# EAGLE design ATMEGA328_SUMO (EAGLE 9.5.2)
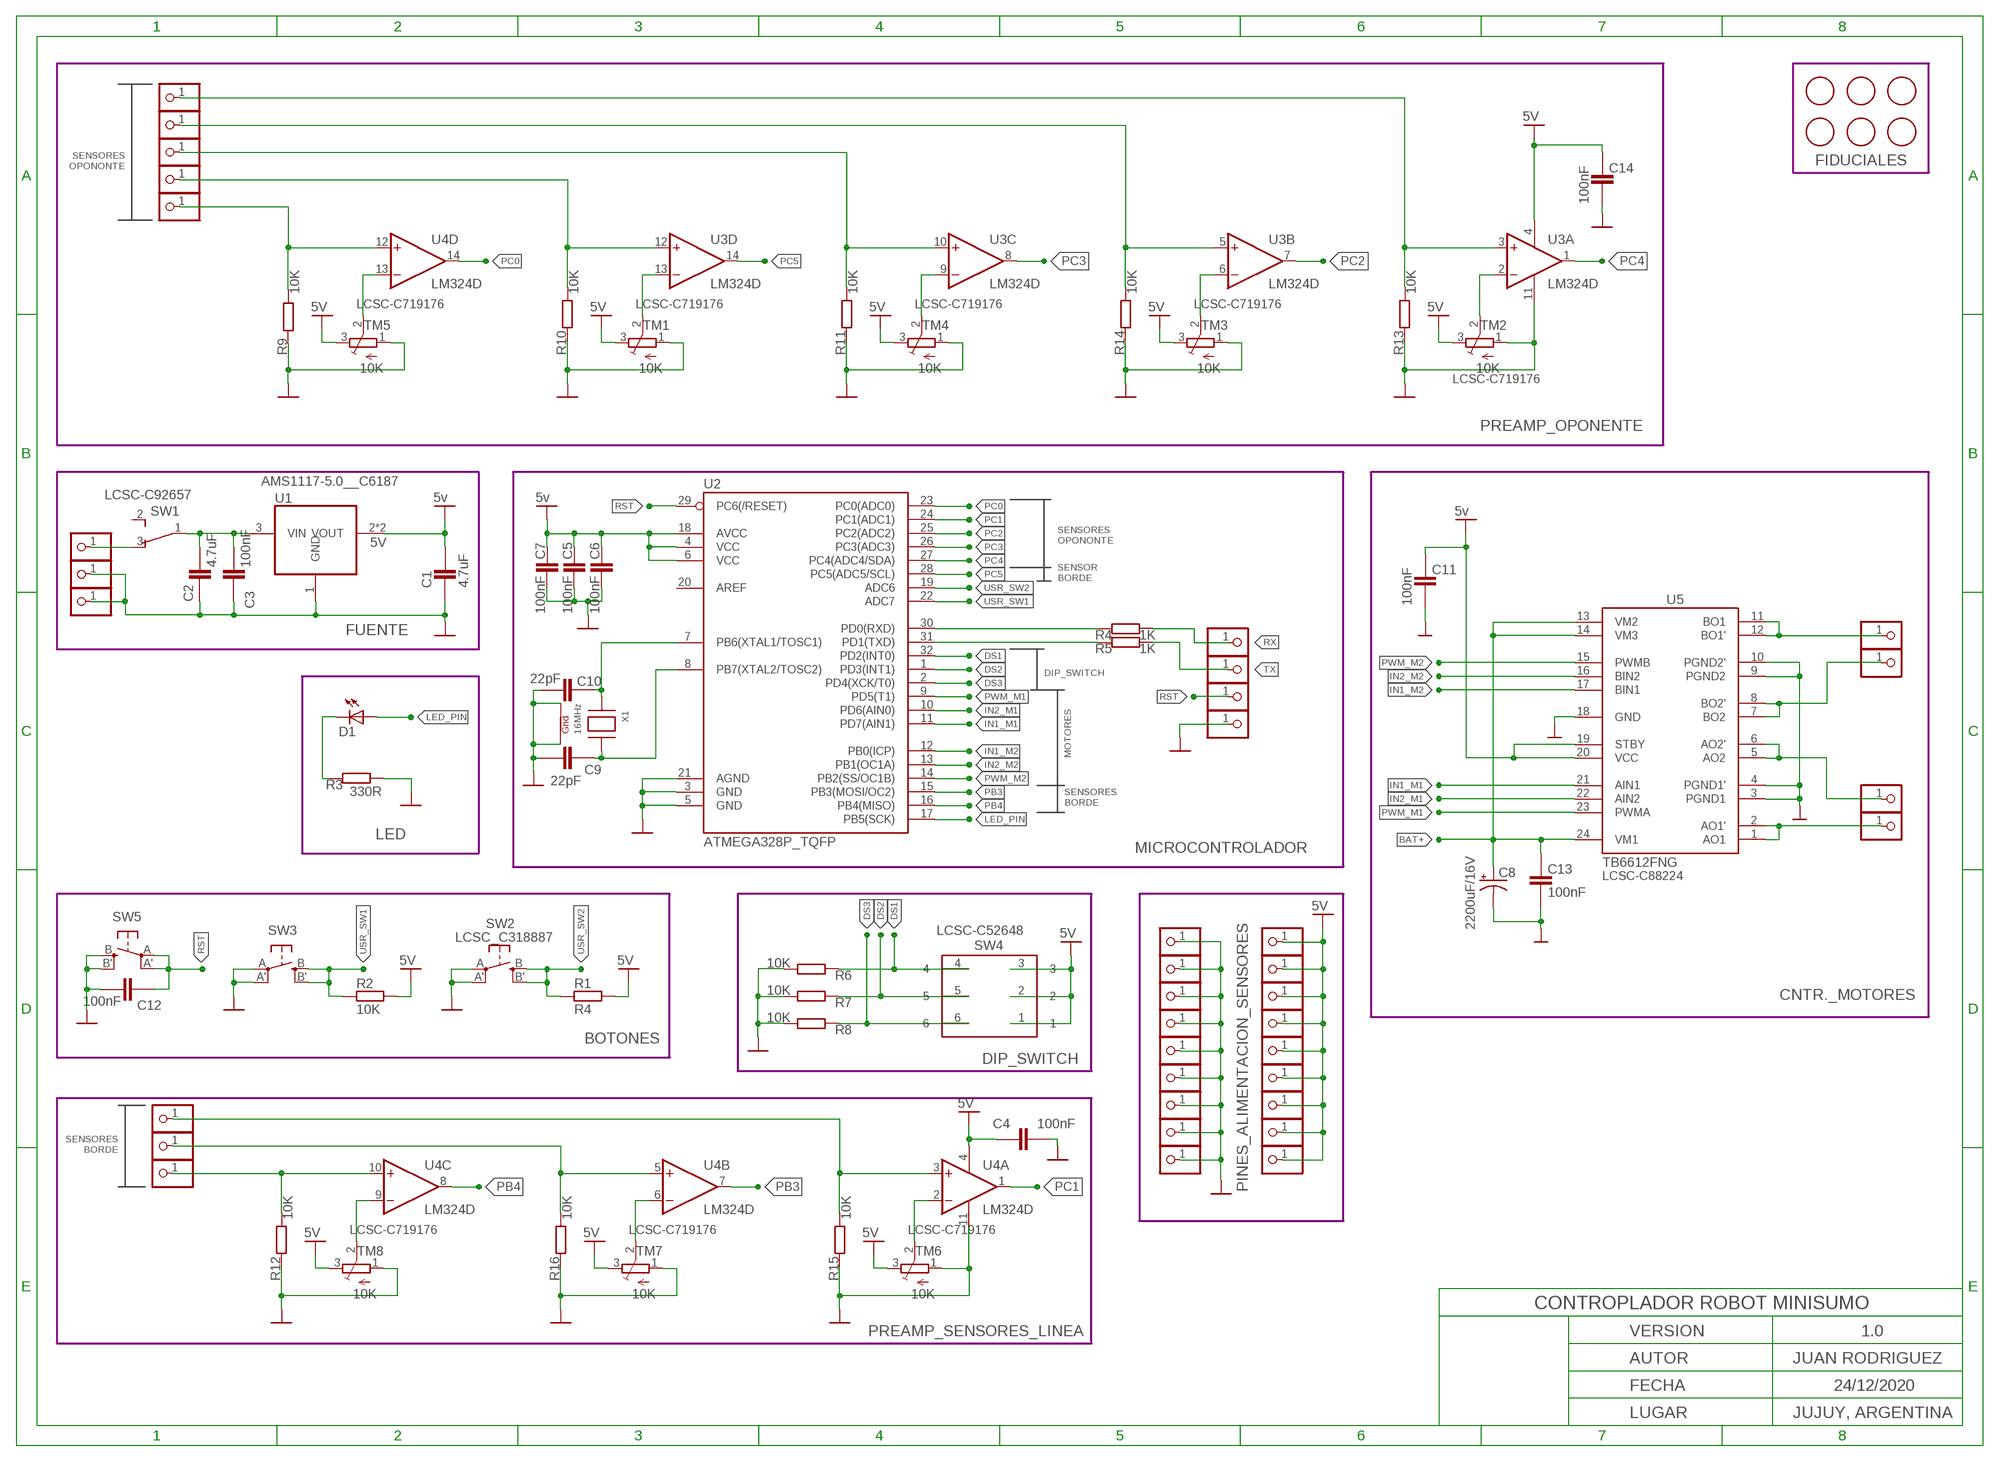
[diagram p0: schematic, sheet 1]

## Parts
C1  4.7uF  CAPACITOR_0603  [CAPC1608X92N]
C2  4.7uF  CAPACITOR_0603  [CAPC1608X92N]
C3  100nF  CAPACITOR_0603  [CAPC1608X92N]
C4  100nF  CAPACITOR_0603  [CAPC1608X92N]
C5  100nF  C-EUC0603  [C0603]
C6  100nF  C-EUC0603  [C0603]
C7  100nF  C-EUC0603  [C0603]
C8  2200uF/16V  CAP_POLG  [PANASONIC_G]
C9  22pF  CAPACITOR_0603  [CAPC1608X92N]
C10  22pF  CAPACITOR_0603  [CAPC1608X92N]
C11  100nF  CAPACITOR_0603  [CAPC1608X92N]
C12  100nF  CAPACITOR_0603  [CAPC1608X92N]
C13  100nF  CAPACITOR_0603  [CAPC1608X92N]
C14  100nF  CAPACITOR_0603  [CAPC1608X92N]
D1  LEDCHIP-LED0805  [CHIP-LED0805]
JP1  PINHD-1X1  [1X01]
JP2  PINHD-1X1  [1X01]
JP3  PINHD-1X1  [1X01]
JP4  PINHD-1X1  [1X01]
JP5  PINHD-1X1  [1X01]
JP6  PINHD-1X1  [1X01]
JP7  PINHD-1X1  [1X01]
JP8  PINHD-1X1  [1X01]
JP9  PINHD-1X1  [1X01]
JP10  PINHD-1X1  [1X01]
JP11  PINHD-1X1  [1X01]
JP12  PINHD-1X1  [1X01]
JP13  PINHD-1X1  [1X01]
JP14  PINHD-1X1  [1X01]
JP15  PINHD-1X1  [1X01]
JP16  PINHD-1X1  [1X01]
JP17  PINHD-1X1  [1X01]
JP18  PINHD-1X1  [1X01]
JP19  PINHD-1X1  [1X01]
JP20  PINHD-1X1  [1X01]
JP21  PINHD-1X1  [1X01]
JP22  PINHD-1X1  [1X01]
JP23  PINHD-1X1  [1X01]
JP24  PINHD-1X1  [1X01]
JP25  PINHD-1X1  [1X01]
JP26  PINHD-1X1  [1X01]
JP27  PINHD-1X1  [1X01]
JP28  PINHD-1X1  [1X01]
JP29  PINHD-1X1  [1X01]
JP30  PINHD-1X1  [1X01]
JP31  PINHD-1X1  [1X01]
JP32  PINHD-1X1  [1X01]
JP33  PINHD-1X1  [1X01]
MOT-1A1  PINHD-1X1  [1X01]
MOT-1A2  PINHD-1X1  [1X01]
MOT-1B1  PINHD-1X1  [1X01]
MOT-1B2  PINHD-1X1  [1X01]
R1  R4  RESISTOR_0603  [RESC1608X55N]
R2  10K  RESISTOR_0603  [RESC1608X55N]
R3  330R  RESISTOR_0603  [RESC1608X55N]
R4  1K  RESISTOR_0603  [RESC1608X55N]
R5  1K  RESISTOR_0603  [RESC1608X55N]
R6  10K  RESISTOR_0603  [RESC1608X55N]
R7  10K  RESISTOR_0603  [RESC1608X55N]
R8  10K  RESISTOR_0603  [RESC1608X55N]
R9  10K  RESISTOR_0603  [RESC1608X55N]
R10  10K  RESISTOR_0603  [RESC1608X55N]
R11  10K  RESISTOR_0603  [RESC1608X55N]
R12  10K  RESISTOR_0603  [RESC1608X55N]
R13  10K  RESISTOR_0603  [RESC1608X55N]
R14  10K  RESISTOR_0603  [RESC1608X55N]
R15  10K  RESISTOR_0603  [RESC1608X55N]
R16  10K  RESISTOR_0603  [RESC1608X55N]
SW1  LCSC-C92657  450302014072  [450302014072]
SW2  LCSC_C318887  SPST_TACT-EVQQ2  [EVQ-Q2]
SW3  SPST_TACT-EVQQ2__C318887  SPST_TACT-EVQQ2  [EVQ-Q2]
SW4  LCSC-C52648  418117170903  [418117170903]
SW5  SPST_TACT-EVQQ2__C318887  SPST_TACT-EVQQ2  [EVQ-Q2]
TM1  10K  TRIMPOTTC33X  [TC33X]
TM2  10K  TRIMPOTTC33X  [TC33X]
TM3  10K  TRIMPOTTC33X  [TC33X]
TM4  10K  TRIMPOTTC33X  [TC33X]
TM5  10K  TRIMPOTTC33X  [TC33X]
TM6  10K  TRIMPOTTC33X  [TC33X]
TM7  10K  TRIMPOTTC33X  [TC33X]
TM8  10K  TRIMPOTTC33X  [TC33X]
U1  AMS1117-5.0__C6187  REG1118-5  [SOT-223]
U2  ATMEGA328P_TQFP  [TQFP32-08]
U3  LM324D  [SO14]
U4  LM324D  [SO14]
U5  TB6612FNG  [SSOP24]
U$1  FIDUCIAL  [FIDUCIAL_1MM]
U$3  FIDUCIAL  [FIDUCIAL_1MM]
U$4  FIDUCIAL  [FIDUCIAL_1MM]
U$100  FIDUCIAL  [FIDUCIAL_1MM]
U$101  FIDUCIAL  [FIDUCIAL_1MM]
U$102  FIDUCIAL  [FIDUCIAL_1MM]
X1  16MHz  XTAL-4-3225  [NX3225]

## Module instances
PREAMP_SENSORES_LINEA = PREAMP_LINEA
FUENTE = POWER_SUPPLY
LED = IRL_Y_EDS
BOTONES = BOTONES
DIP_SWITCH = DIP_SWWITCH
MICROCONTROLADOR = MICROCONTROLADOR
CNTR._MOTORES = CONTR._MOTORES
PINES_ALIMENTACION_SENSORES = PINES_ALIMENTACION_SENSORES
FIDUCIALES = FIDUCIALES
PREAMP_OPONENTE = PREAMP_OPONENTE

## Nets
5V: C1.2 C4.1 C5.1 C6.1 C7.1 C11.1 C14.1 JP16.1 JP17.1 JP18.1 JP19.1 JP20.1 JP21.1 JP22.1 JP23.1 JP24.1 R1.2 R2.2 SW4.1 SW4.2 SW4.3 TM1.3(E) TM2.3(E) TM3.3(E) TM4.3(E) TM5.3(E) TM6.3(E) TM7.3(E) TM8.3(E) U1.2(VOUT) U1.4(VOUT) U2.4(VCC) U2.6(VCC) U2.18(AVCC) U3.4(P:V+) U4.4(P:V+) U5.19(STBY) U5.20(VCC) ; supply symbol labelled 5v
BAT+: C2.2 C3.2 C8.+ C13.2 SW1.1 U1.3(VIN) U5.13(VM2) U5.14(VM3) U5.24(VM1)
DS1: R6.1 SW4.4 U2.32(PD2(INT0))
DS2: R7.1 SW4.5 U2.1(PD3(INT1))
DS3: R8.1 SW4.6 U2.2(PD4(XCK/T0))
GND: C1.1 C2.1 C3.1 C4.2 C5.2 C6.2 C7.2 C8.- C9.2 C10.2 C11.2 C12.2 C13.1 C14.2 JP2.1 JP3.1 JP4.1 JP25.1 JP26.1 JP27.1 JP28.1 JP29.1 JP30.1 JP31.1 JP32.1 JP33.1 R3.1 R6.2 R7.2 R8.2 R9.2 R10.1 R11.1 R12.1 R13.1 R14.1 R15.1 R16.1 SW2.A'(P1) SW2.A(P) SW3.A'(P1) SW3.A(P) SW5.B'(S1) SW5.B(S) TM1.1(A) TM2.1(A) TM3.1(A) TM4.1(A) TM5.1(A) TM6.1(A) TM7.1(A) TM8.1(A) U1.1(GND) U2.3(GND) U2.5(GND) U2.21(AGND) U3.11(P:V-) U4.11(P:V-) U5.3(PGND1) U5.4(PGND1') U5.9(PGND2) U5.10(PGND2') U5.18(GND) X1.2(G2) X1.4(G1)
IN1_M1: U2.11(PD7(AIN1)) U5.21(AIN1)
IN1_M2: U2.12(PB0(ICP)) U5.17(BIN1)
IN2_M1: U2.10(PD6(AIN0)) U5.22(AIN2)
IN2_M2: U2.13(PB1(OC1A)) U5.16(BIN2)
LED_PIN: D1.A U2.17(PB5(SCK))
N$1: D1.C R3.2
N$5: JP10.1 R14.2 U3.5(B:+IN)
N$7: JP11.1 R11.2 U3.10(C:+IN)
N$10: TM2.2(S) U3.2(A:-IN)
N$11: TM3.2(S) U3.6(B:-IN)
N$12: TM4.2(S) U3.9(C:-IN)
N$15: MOT-1B2.1 U5.5(AO2) U5.6(AO2')
N$16: TM1.2(S) U3.13(D:-IN)
N$18: TM5.2(S) U4.13(D:-IN)
N$19: JP12.1 R9.1 U4.12(D:+IN)
N$20: TM6.2(S) U4.2(A:-IN)
N$21: JP8.1 R10.2 U3.12(D:+IN)
N$22: JP13.1 R15.2 U4.3(A:+IN)
N$23: JP9.1 R13.2 U3.3(A:+IN)
N$24: MOT-1B1.1 U5.1(AO1) U5.2(AO1')
N$26: C9.1 U2.8(PB7(XTAL2/TOSC2)) X1.1(X1)
N$27: C10.1 U2.7(PB6(XTAL1/TOSC1)) X1.3(X2)
N$28: MOT-1A2.1 U5.11(BO1) U5.12(BO1')
N$29: MOT-1A1.1 U5.7(BO2) U5.8(BO2')
N$31: TM7.2(S) U4.6(B:-IN)
N$38: JP15.1 R16.2 U4.5(B:+IN)
N$41: JP1.1 SW1.3
N$47: TM8.2(S) U4.9(C:-IN)
N$48: JP14.1 R12.2 U4.10(C:+IN)
PB3: U2.15(PB3(MOSI/OC2)) U4.7(B:OUT)
PB4: U2.16(PB4(MISO)) U4.8(C:OUT)
PC0: U2.23(PC0(ADC0)) U4.14(D:OUT)
PC1: U2.24(PC1(ADC1)) U4.1(A:OUT)
PC2: U2.25(PC2(ADC2)) U3.7(B:OUT)
PC3: U2.26(PC3(ADC3)) U3.8(C:OUT)
PC4: U2.27(PC4(ADC4/SDA)) U3.1(A:OUT)
PC5: U2.28(PC5(ADC5/SCL)) U3.14(D:OUT)
PWM_M1: U2.9(PD5(T1)) U5.23(PWMA)
PWM_M2: U2.14(PB2(SS/OC1B)) U5.15(PWMB)
RST: C12.1 JP5.1 SW5.A'(P1) SW5.A(P) U2.29(PC6(/RESET))
RX: JP6.1 R4.1
RX.: R4.2 U2.30(PD0(RXD))
TX: JP7.1 R5.1
TX.: R5.2 U2.31(PD1(TXD))
USR_SW1: R2.1 SW3.B'(S1) SW3.B(S) U2.22(ADC7)
USR_SW2: R1.1 SW2.B'(S1) SW2.B(S) U2.19(ADC6)
Unconnected: SW1.2 U2.20(AREF)

## Notes on the sheet
- SENSORES
  OPONONTE
- LCSC-C719176 | LCSC-C719176 | LCSC-C719176 | LCSC-C719176
- LCSC-C719176
- SENSORES
  OPONONTE
- SENSOR
  BORDE
- DIP_SWITCH
- MOTORES
- SENSORES
  BORDE
- LCSC-C88224
- SENSORES
  BORDE
- LCSC-C719176 | LCSC-C719176 | LCSC-C719176
- CONTROPLADOR ROBOT MINISUMO
- VERSION | 1.0
- AUTOR | JUAN RODRIGUEZ
- FECHA | 24/12/2020
- LUGAR | JUJUY, ARGENTINA

## Library data of the parts
C1-C4 C9-C14 = ipc-7351-capacitor:CAPACITOR_
C5-C7 = rcl:C-EU: CAPACITOR, European symbol
C8 = SparkFun-Passives:CAP_POL: Capacitor Polarized These are standard SMD and PTH capacitors. Normally 10uF, 47uF, and 100uF in electrolytic and tantalum varieties. Always verify the external diameter of the through hole cap, it varies with capacity, voltage, and manufacturer. The EIA devices should be standard.
D1 = adafruit:LED: LED OSRAM: - CHIPLED LG R971, LG N971, LY N971, LG Q971, LY Q971, LO R971, LY R971 LH N974, LH R974 LS Q976, LO Q976, LY Q976 LO Q996 - Hyper CHIPLED LW Q18S LB Q993, LB Q99A, LB R99A - SideLED LS A670, LO A670, LY A670, LG A670, LP A670 LB A673, LV A673, LT A673, LW A673 LH A674 LY A675 LS A676, LA A676, LO A676, LY A676, LW A676 LS A679, LY A679, LG A679 - Hyper Micro SIDELED® LS Y876, LA Y876, LO Y876, LY Y876 LT Y87S - SmartLED LW L88C, LW L88S LB L89C, LB L89S, LG L890 LS L89K, LO L89K, LY L89K LS L896, LA L896, LO L896, LY L896 - TOPLED LS T670, LO T670, LY T670, LG T670, LP T670 LSG T670, LSP T670, LSY T670, LOP T670, LYG T670 LG T671, LOG T671, LSG T671 LB T673, LV T673, LT T673, LW T673 LH T674 LS T676, LA T676, LO T676, LY T676, LB T676, LH T676, LSB T676, LW T676 LB T67C, LV T67C, LT T67C, LS T67K, LO T67K, LY T67K, LW E67C LS E67B, LA E67B, LO E67B, LY E67B, LB E67C, LV E67C, LT E67C LW T67C LS T679, LY T679, LG T679 LS T770, LO T770, LY T770, LG T770, LP T770 LB T773, LV T773, LT T773, LW T773 LH T774 LS E675, LA E675, LY E675, LS T675 LS T776, LA T776, LO T776, LY T776, LB T776 LHGB T686 LT T68C, LB T68C - Hyper Mini TOPLED® LB M676 - Mini TOPLED Santana® LG M470 LS M47K, LO M47K, LY M47K Source: http://www.osram.convergy.de/
JP1-JP33 MOT-1A1 MOT-1A2 MOT-1B1 MOT-1B2 = adafruit:PINHD-1X1: Pin header 1x1 for 0.1" spacing With round pins
R1-R16 = ipc-7351-resistor:RESISTOR_
SW1 = Eagle_Wuerth_Elektronik_Switch_rev15b:450302014072: WS-SUT, 10mm*2.5mm, SPDT, ON-ON, 2.54mm, right angle type, THT, Mini Slide Switch, 3 pins
SW2 SW3 SW5 = adafruit:SPST_TACT: SMT 6mm switch, EVQQ2 series http://www.ladyada.net/library/eagle
SW4 = Eagle_Wuerth_Elektronik_Switch_rev15b:418117170903: WS-BS 2.54 mm compact THT Dip Switch with flat actuator, 3 Pole
TM1-TM8 = adafruit:TRIMPOT: SMT trimmer potentiometer part number TC33X http://www.ladyada.net/library/eagle
U1 = burr-brown:REG1118-5: AMS1117 5V 1A LCSC N° C6187
U2 = SparkFun-DigitalIC:ATMEGA328P_TQFP; PROD_ID: IC-09069
U3 U4 = gm-ics:LM324: OP AMP
U5 = adafruit:TB6612FNG: TB6612FNG MOS dual H-bridge motor driver, 1.2A current 3.2A peak 3 or 5v logic and 3-15v motor
U$1 U$3 U$4 U$100-U$102 = adafruit:FIDUCIAL: For use by pick and place machines to calibrate the vision/machine, 1mm By microbuilder.eu
X1 = adafruit:XTAL-4: Classic 4-pin 3.2 x 2.5mm crystal

## Module PREAMP_LINEA
Ports: 

### Library data of the parts

## Module POWER_SUPPLY
Ports: 

### Library data of the parts

## Module IRL_Y_EDS
Ports: 

### Library data of the parts

## Module BOTONES
Ports: 

### Library data of the parts

## Module DIP_SWWITCH
Ports: 

### Library data of the parts

## Module MICROCONTROLADOR
Ports: 

### Library data of the parts

## Module CONTR._MOTORES
Ports: 

### Library data of the parts

## Module PINES_ALIMENTACION_SENSORES
Ports: 

### Library data of the parts

## Module FIDUCIALES
Ports: 

### Library data of the parts

## Module PREAMP_OPONENTE
Ports: 

### Library data of the parts

## Board
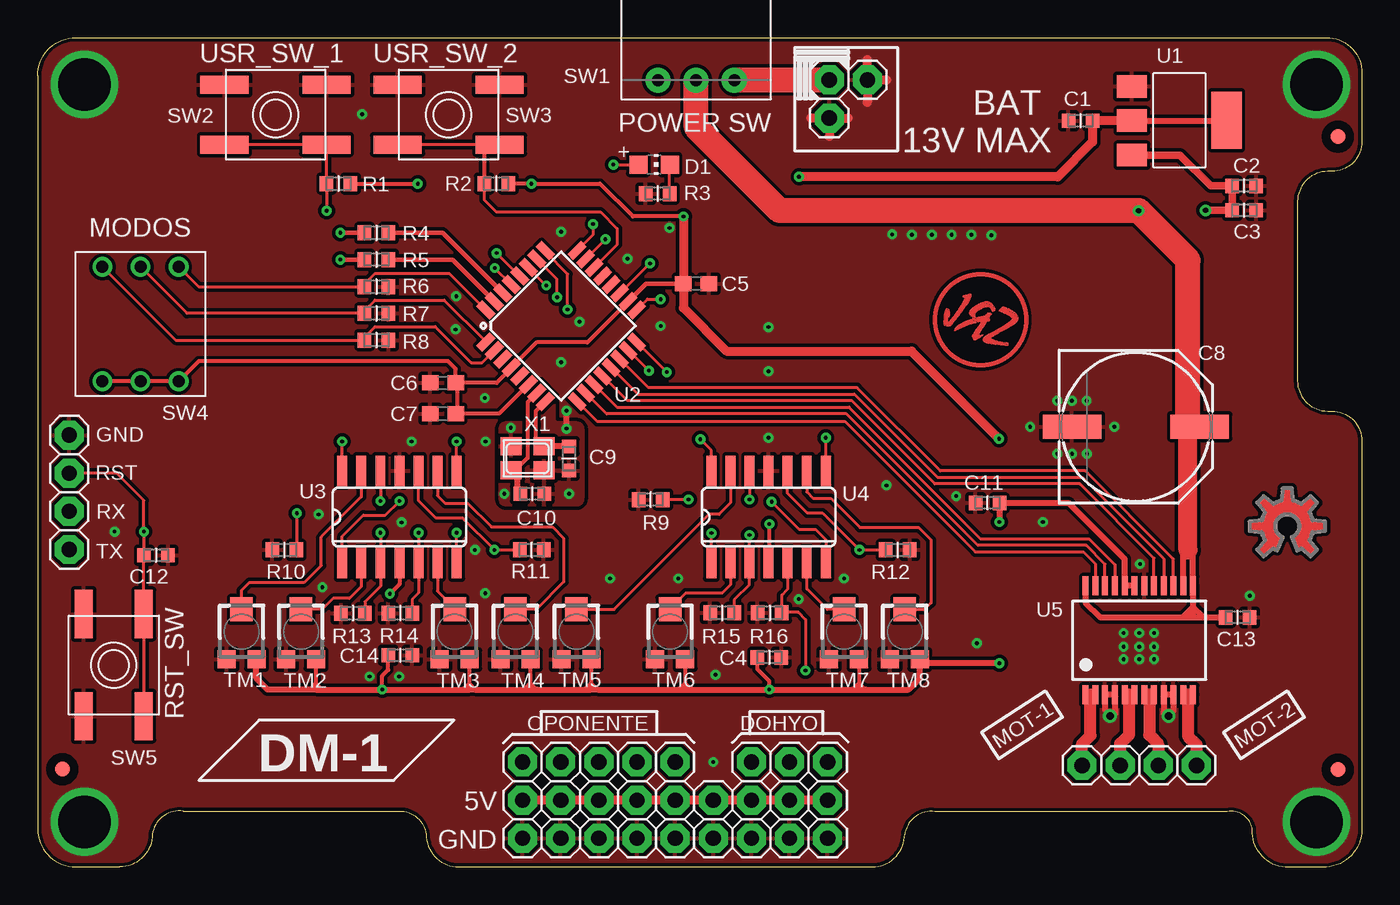
[diagram p1: board, top side]
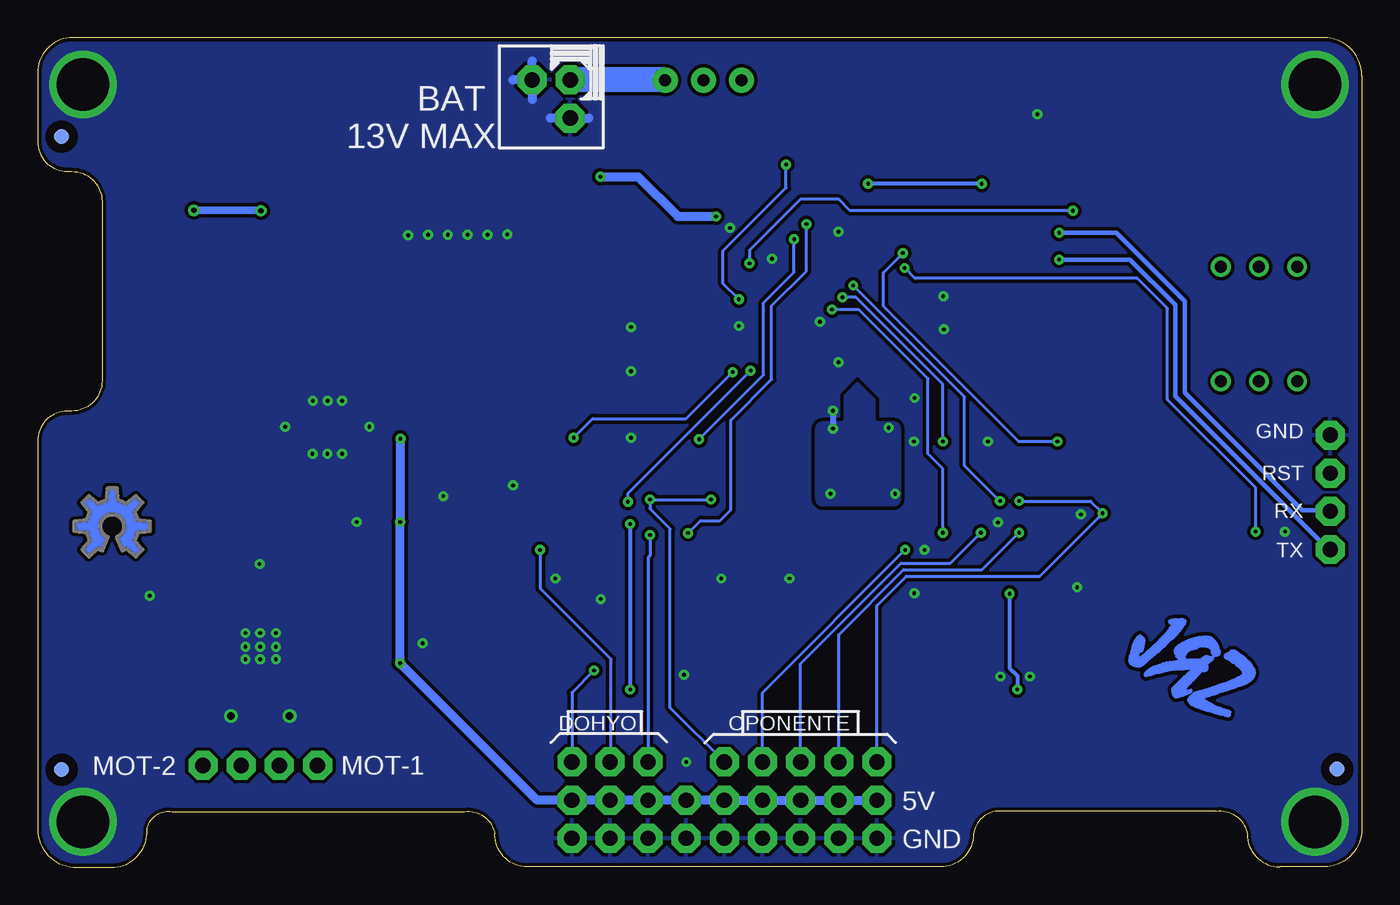
[diagram p2: board, bottom side, seen from below]

Size 88.21 x 55.24 mm. Coordinates in mm from the lower left corner, seen from the top.
Outline: 80.92,2.51 arc90 79.25,3.71 59.76,3.71 arc90 57.76,2.19 arc-90 55.59,0.03 28.05,0.03 arc-90 25.88,2.19 arc90 23.93,3.73 9.7,3.73 arc90 7.65,2.19 arc-90 5.48,0.03 2.54,0.03 arc-90 0,2.57 0,52.7 arc-90 2.54,55.24 85.84,55.24 arc-90 88.21,52.87 88.21,48.33 arc-90 86.21,46.33 85.92,46.33 arc90 83.92,44.33 83.92,32.38 arc90 85.92,30.38 86.21,30.38 arc-90 88.21,28.38 88.21,2.53 arc-90 85.61,0 83.11,0 arc-90 80.92,2.51
Copper layers (1*16): Top 0.035mm / dielectric 1.5mm / Bottom 0.035mm
Design rules "default *": minimum track width 6mil, minimum drill 0.25mm, track to track 9mil, track to pad 8mil, pad to pad 8mil, via to via 8mil, smd to smd 8mil, copper to edge 10mil, drill to drill 7mil, minimum pad ring 10mil, minimum via ring 8mil, stop-mask expansion 4mil, vias tented up to drill 0mil, thermal gap 10mil
tRestrict: 14 lines
bRestrict: 13 lines

### Footprints (pad centres in the part's own frame; a part is rotated, then mirrored left to right if it is on the bottom)
CAPC1608X92N = smd 0.9 x 0.95: 1 -0.8,0; 2 0.8,0
C0603 = smd 1.1 x 1: 1 -0.85,0; 2 0.85,0
PANASONIC_G = smd 3.9 x 1.6: + 4.25,0; - -4.25,0
CHIP-LED0805 = smd 1.2 x 1.2: A 0,-1.05; C 0,1.05
1X01 = drill 1.016 pad 1.93 octagon: 1 0,0
RESC1608X55N = smd 0.9 x 1: 1 -0.8,0; 2 0.8,0
450302014072 = drill 0.8 pad 1.676: 1 0,0; 2 -2.54,0; 3 2.54,0
EVQ-Q2 = smd 3.2 x 1.2: A -3.4,-2; A' 3.4,-2; B -3.4,2; B' 3.4,2
418117170903 = drill 0.8: 1 0,-3.81; 2 2.54,-3.81; 3 5.08,-3.81; 4 5.08,3.81; 5 2.54,3.81; 6 0,3.81
TC33X = smd 1.2 x 1.2: 1 -1,-1.825; 3 1,-1.825 | smd 1.5 x 1.6: 2 0,1.5
SOT-223 = smd 1.499 x 2.007: 1 -2.261,-3.15; 2 0.025,-3.15; 3 2.311,-3.15 | smd 3.81 x 2.007: 4 0,3.15
TQFP32-08 = smd 1.27 x 0.559: 1 -4.293,2.8; 2 -4.293,2; 3 -4.293,1.2; 4 -4.293,0.4; 5 -4.293,-0.4; 6 -4.293,-1.2; 7 -4.293,-2; 8 -4.293,-2.8; 17 4.293,-2.8; 18 4.293,-2; 19 4.293,-1.2; 20 4.293,-0.4; 21 4.293,0.4; 22 4.293,1.2; 23 4.293,2; 24 4.293,2.8 | smd 0.559 x 1.27: 9 -2.8,-4.293; 10 -2,-4.293; 11 -1.2,-4.293; 12 -0.4,-4.293; 13 0.4,-4.293; 14 1.2,-4.293; 15 2,-4.293; 16 2.8,-4.293; 25 2.8,4.293; 26 2,4.293; 27 1.2,4.293; 28 0.4,4.293; 29 -0.4,4.293; 30 -1.2,4.293; 31 -2,4.293; 32 -2.8,4.293
SO14 = smd 0.66 x 2.032: 1 -3.81,-3.073; 2 -2.54,-3.073; 3 -1.27,-3.073; 4 0,-3.073; 5 1.27,-3.073; 6 2.54,-3.073; 7 3.81,-3.073; 8 3.81,3.073; 9 2.54,3.073; 10 1.27,3.073; 11 0,3.073; 12 -1.27,3.073; 13 -2.54,3.073; 14 -3.81,3.073
SSOP24 = smd 0.4 x 1.25: 1 -3.575,-3.625; 2 -2.925,-3.625; 3 -2.275,-3.625; 4 -1.625,-3.625; 5 -0.975,-3.625; 6 -0.325,-3.625; 7 0.325,-3.625; 8 0.975,-3.625; 9 1.625,-3.625; 10 2.275,-3.625; 11 2.925,-3.625; 12 3.575,-3.625; 13 3.575,3.625; 14 2.925,3.625; 15 2.275,3.625; 16 1.625,3.625; 17 0.975,3.625; 18 0.325,3.625; 19 -0.325,3.625; 20 -0.975,3.625; 21 -1.625,3.625; 22 -2.275,3.625; 23 -2.925,3.625; 24 -3.575,3.625
FIDUCIAL_1MM = smd 1 x 1: 1 0,0
NX3225 = smd 1.4 x 1.2: 1 -1.1,-0.8; 2 1.1,-0.8; 3 1.1,0.8; 4 -1.1,0.8

### Placement (x,y rotation side)
C1  69.47,49.71 0 top
C2  80.37,45.36 180 top
C3  80.37,43.74 180 top
C4  48.74,13.97 0 top
C5  43.87,38.86 0 top
C6  27,32.26 180 top
C7  27,30.2 180 top
C8  73.15,29.34 0 top
C9  35.39,27.22 270 top
C10  32.94,24.87 0 top
C11  63.27,24.26 180 top
C12  7.9,20.78 0 top
C13  79.93,16.64 180 top
C14  24.16,14.12 0 top
D1  41.07,46.79 270 top
JP1  52.73,52.43 180 top
JP2  55.27,52.43 180 top
JP3  52.73,49.89 180 top
JP4  2.11,28.78 180 top
JP5  2.11,26.24 270 top
JP6  2.11,23.7 90 top
JP7  2.11,21.16 0 top
JP8  32.31,7.01 180 top
JP9  34.85,7.01 180 top
JP10  37.39,7.01 0 top
JP11  39.93,7.01 180 top
JP12  42.47,7.01 180 top
JP13  47.55,7.01 0 top
JP14  50.09,7.01 180 top
JP15  52.63,7.01 270 top
JP16  32.31,4.47 180 top
JP17  34.85,4.47 90 top
JP18  37.39,4.47 90 top
JP19  39.93,4.47 90 top
JP20  42.47,4.47 90 top
JP21  45.01,4.47 90 top
JP22  47.55,4.47 90 top
JP23  50.09,4.47 90 top
JP24  52.63,4.47 90 top
JP25  32.31,1.93 180 top
JP26  34.85,1.93 90 top
JP27  37.39,1.93 90 top
JP28  39.93,1.93 90 top
JP29  42.47,1.93 180 top
JP30  45.01,1.93 180 top
JP31  47.55,1.93 180 top
JP32  50.09,1.93 180 top
JP33  52.63,1.93 180 top
MOT-1A1  74.65,6.78 0 top
MOT-1A2  77.19,6.78 0 top
MOT-1B1  69.57,6.78 0 top
MOT-1B2  72.11,6.78 0 top
R1  20.04,45.52 0 top
R2  30.56,45.52 0 top
R3  41.3,44.86 0 top
R4  22.58,42.24 0 top
R5  22.58,40.46 0 top
R6  22.58,38.66 0 top
R7  22.58,36.88 0 top
R8  22.58,35.1 0 top
R9  40.84,24.49 180 top
R10  16.43,21.13 0 top
R11  32.92,21.13 180 top
R12  57.3,21.13 180 top
R13  21.01,16.92 0 top
R14  24.16,16.92 0 top
R15  45.59,16.94 0 top
R16  48.77,16.94 0 top
SW1  43.87,52.4 0 top
SW2  15.85,50.11 180 top
SW3  27.38,50.11 180 top
SW4  4.32,36.17 0 top
SW5  5.08,13.46 90 top
TM1  13.59,15.67 0 top
TM2  17.55,15.67 0 top
TM3  27.79,15.67 0 top
TM4  31.83,15.67 0 top
TM5  35.89,15.67 0 top
TM6  42.14,15.67 0 top
TM7  53.72,15.67 0 top
TM8  57.76,15.67 0 top
U1  76.05,49.73 270 top
U2  34.88,36.04 45 top
U3  24.1,23.32 0 top
U4  48.69,23.32 0 top
U5  73.38,15.11 0 top
U$1  86.61,48.64 0 top
U$2  [LOGO_B]  10.84,13.15 33 top
U$3  1.65,6.53 0 top
U$4  86.61,6.5 0 top
U$6  [OSHWLOGO_TOP_0.2]  83.24,22.71 0 top
U$7  [OSHWLOGO_TOP_0.2]  83.24,22.71 0 bottom
U$100  86.61,6.5 0 bottom
U$101  1.65,6.53 0 bottom
U$102  86.61,48.64 0 bottom
X1  32.64,27.23 180 top

### Tracks (layer width: path | path; a pad name or v marks a point on that pad's centre or on a via)
5V  (via drill 0.25)
  Top 0.203: 27.94,30.2 C7.1 | U2.4 31.56,33.24 | 31.56,33.24 | U2.18 | U2.6
  Top 0.254: U4.4 48.74,20.29 v48.74,22.86 | SW4.1 SW4.2 SW4.3 10.74,33.71 27.33,33.71 27.85,33.19 C6.1 | U2.18 36.62,34.95 33.22,34.95 U2.4 31.56,33.24 30.58,32.26 C6.1 | R2.2 v32.89,45.52 37.46,45.52 39.65,43.33 v43.03,43.33 | TM1.3 14.56,13.82 | 28.76,12.25 28.76,13.66 28.79,13.69 TM3.3 | 28.76,12.23 28.76,11.85 28.78,11.84 | TM2.3 18.53,13.82 18.53,12.26 | 28.76,12.25 28.35,11.84 | 28.76,12.25 28.76,12.23 | 28.76,12.23 29.16,11.84 | 18.53,12.26 18.95,11.84 | 18.53,12.25 | 18.53,12.25 18.11,11.84 18.53,12.25 | C6.1 27.94,32.17 27.94,30.2 30.74,30.2 U2.6 | TM6.3 43.13,13.84 43.13,12.27 | TM5.3 36.86,13.81 36.86,12.27 | 36.86,12.24 36.86,11.85 36.84,11.84 | 36.86,12.27 37.29,11.84 | 36.86,12.27 36.86,12.24 | 36.86,12.24 36.45,11.84 | 18.53,12.25 18.53,12.26 | U3.4 24.1,18.85 v23.47,18.21 | R1.2 v25.32,45.52 | TM7.3 54.72,12.25 | 54.72,12.25 54.72,11.85 54.71,11.84 | 54.72,12.25 54.3,11.84 | 54.72,12.26 55.14,11.84 | 43.13,12.27 43.13,11.84 | 43.13,12.27 42.7,11.84 | 43.13,12.27 43.56,11.84 | TM4.3 32.82,12.27 | 32.82,12.27 32.82,11.84 | 32.82,12.27 32.38,11.84 | 32.82,12.27 33.25,11.84 | 18.53,12.26 18.51,12.24 18.51,11.84 | TM8.3 59.02,13.59 | 64.07,23 v64.06,22.99 | v22.96,11.84 22.96,12.75 23.36,13.14 C14.1 | v48.74,11.84 48.74,12.39 47.94,13.19 C4.1
  Top 0.305: C5.1 40.53,38.86 U2.18
  Top 0.406: U5.19 U5.20 72.41,20.52 68.67,24.26 C11.1 64.07,23 | U1.2 79.17,49.71 U1.4 | 14.56,13.82 14.56,12.59 15.32,11.84 18.11,11.84 18.51,11.84 | 18.54,11.84 18.95,11.84 v22.96,11.84 28.35,11.84 28.78,11.84 29.16,11.84 32.38,11.84 32.82,11.84 33.25,11.84 36.45,11.84 36.84,11.84 37.29,11.84 42.7,11.84 43.13,11.84 43.56,11.84 v48.74,11.84 54.3,11.84 54.71,11.84 55.14,11.84 58.02,11.84 58.76,12.58 TM8.3 | v64.06,13.59 59.02,13.59
  Top 0.61: JP24.1 JP23.1 JP22.1 JP21.1 JP20.1 JP19.1 JP18.1 JP17.1 JP16.1 | U1.2 C1.2 70.27,48.3 67.94,45.97 v50.72,45.97 | v64.04,28.53 58.21,34.37 45.89,34.37 43.02,37.24 C5.1 43.03,38.87 v43.03,43.33
  Bottom 0.254: v23.47,18.21 23.47,13.26 22.96,12.75 v22.96,11.84 | v25.32,45.52 v32.89,45.52 | v48.74,22.86 v48.74,11.84
  Bottom 0.61: JP16.1 JP20.1 JP24.1 54.94,4.47 v64.06,13.59 v64.06,22.99 64.06,28.52 v64.04,28.53 | v50.72,45.97 48.21,45.97 45.57,43.33 v43.03,43.33
BAT+  (via drill 0.35)
  Top 0.406: U5.24 69.81,17.62 70.79,16.64 76.28,16.64 | 76.96,17.33 U5.13 76.96,20.81 76.63,21.13 76.31,20.81 U5.14 | 76.96,17.32 76.96,16.64 | 76.28,16.64 76.96,16.64 | 76.96,16.64 77.65,16.64 | 77.65,16.64 C13.2 | 76.96,17.33 77.65,16.64 | 76.96,17.33 76.96,17.32 | 76.96,17.32 76.28,16.64
  Top 0.508: U1.3 76.1,47.42 78.16,45.36 C2.2 C3.2 v77.8,43.74
  Top 1.27: 76.63,21.13 76.63,29.34 C8.+
  Top 1.65: SW1.1 43.87,49.28 49.43,43.71 v73.34,43.71 76.64,40.41 76.63,40.41 76.63,29.34
  Bottom 0.508: v77.8,43.74 73.36,43.74 v73.34,43.71
DS1
  Top 0.203: SW4.4 10.72,38.66 R6.1 21.78,38.85 22.48,39.55 27.41,39.55 U2.32 | U2.32
DS2
  Top 0.203: SW4.5 9.96,36.88 R7.1 21.78,37.07 22.48,37.77 27.08,37.77 U2.1 | U2.1
DS3
  Top 0.203: SW4.6 9.19,35.1 R8.1 21.78,35.29 22.48,35.99 26.49,35.99 28.88,33.6 29.62,33.6 U2.2
GND  (via drill 0.25, 0.5, 3.5)
  Top 0.406: 35.22,29.25 35.22,30.47 | U5.4 U5.3 71.09,11.48 71.09,10.46 | U5.4 | U5.4 71.76,10.21 71.63,10.08 v71.42,10.08 | U5.10 U5.9 75.01,10.34 74.99,10.32 74.99,10.26 75.17,10.08 v75.34,10.08 75.34,10.11 75.66,10.43 U5.10
  Top 0.61: JP2.1 55.27,50.93 | JP2.1 56.57,52.43 | JP2.1 55.27,53.77 | JP3.1 54,49.89 | JP3.1 51.51,49.89 | JP3.1 52.73,48.67
  Bottom 0.406: 35.22,30.44 v35.22,29.22
  Bottom 0.61: JP2.1 55.27,51.1 | JP2.1 55.27,53.67 | JP2.1 56.57,52.43 | 54.05,49.89 JP3.1 51.51,49.89
  other vias: 42.67,19.23 31.52,29.26 35.41,24.87 31.09,24.87 5.13,22.35 45.01,7.01 68.91,27.53 67.92,27.53 69.9,27.53 68.88,31.06 67.92,31.06 69.88,31.06 66.12,29.34 71.73,29.34 73.38,14.68 74.37,14.68 72.34,14.68 73.38,13.84 72.34,13.84 74.37,13.84 62.56,14.91 53.72,19.23 35.23,30.4 50.7,17.86 48.69,28.6 21.62,50.14 85.19,52.12 85.19,3.02 3.12,3.02 3.12,52.12 27.84,35.81 27.89,38.02 48.69,33.02 48.69,35.97 41.5,36.04 36.09,36.32 34.87,33.63 29.79,31.24 29.84,28.35 24.26,22.96 29.82,18.24 38.13,19.23 45.16,12.83 63.53,42.09 62.2,42.11 60.88,42.11 59.56,42.11 58.24,42.11 56.92,42.14 42.09,42.57 39.29,40.51 34.87,42.32 56.54,25.43 61.19,24.71 22.12,12.7 18.97,18.64 24.08,12.7 29.13,21.13 18.72,23.5 24.92,28.35 73.38,15.6 72.34,15.6 74.37,15.6 73.43,20.19 66.95,22.99 80.75,18.08
  pour Top (isolate 0.015): -1.83,-1.5 89.87,-1.5 89.87,57.12 -1.83,57.12
  pour Bottom (isolate 0.015): -1.83,57.23 89.87,57.23 89.87,-1.5 -1.83,-1.5
IN1_M1
  Top 0.203: U2.11 38.59,30.63 54.05,30.63 62.82,21.87 70.03,21.87 71.76,20.14 U5.21 | U2.11
IN1_M2
  Top 0.203: U2.12 39.29,31.07 54.23,31.07 59.77,25.53 69.42,25.53 74.36,20.59 U5.17 | U2.12
IN2_M1
  Top 0.203: U2.10 37.91,30.19 53.89,30.19 62.64,21.44 69.85,21.44 71.11,20.18 U5.22 | U2.10
IN2_M2
  Top 0.203: U2.13 39.99,31.5 54.41,31.5 59.95,25.96 69.6,25.96 75.01,20.55 U5.16 | U2.13
LED_PIN  (via drill 0.25)
  Top 0.203: U2.17 40.62,37.82 v41.5,37.82 | v38.35,46.79 D1.A
  Bottom 0.203: v41.5,37.82 42.54,38.86 42.54,41.05 38.35,45.24 v38.35,46.79
N$1
  Top 0.203: R3.2 42.1,46.77 D1.C
N$5  (via drill 0.25)
  Top 0.203: v25.37,22.28 U3.5 25.37,18.26 24.96,17.84 R14.2
  Bottom 0.203: JP10.1 37.39,13.56 30.71,20.24 27.41,20.24 v25.37,22.28
N$7  (via drill 0.25)
  Top 0.203: U3.10 25.37,24.41 26.54,23.24 28.32,23.24 v30.43,21.13 R11.2
  Bottom 0.203: JP11.1 39.93,11.63 v30.43,21.13
N$10
  Top 0.203: U3.2 21.56,18.69 20.78,17.91 19.68,17.91 18.95,17.17 TM2.2
N$11
  Top 0.203: U3.6 26.64,18.39 27.79,17.25 TM3.2
N$12
  Top 0.203: U3.9 26.64,24.74 27.15,24.23 28.65,24.23 30.23,22.66 34.29,22.66 35.05,21.89 35.05,19 33.22,17.17 TM4.2
N$15
  Top 0.406: U5.5 72.72,11.49 U5.6
  Top 0.813: MOT-1B2.1 72.11,8.23 72.72,8.84 72.72,11.49
N$16
  Top 0.203: TM1.2 13.59,18.44 14.1,18.95 17.75,18.95 18.9,20.09 18.9,22 21.56,24.66 U3.13
N$18
  Top 0.203: TM5.2 38.41,17.17 44.73,23.49 45.39,23.49 46.15,24.26 U4.13
N$19  (via drill 0.25)
  Top 0.203: U4.12 v47.42,24.49 | v43.36,24.49 R9.1
  Bottom 0.203: JP12.1 46.08,10.62 46.08,22.53 47.42,23.88 v47.42,24.49 v43.36,24.49
N$20
  Top 0.203: TM6.2 42.14,17.22 43.18,18.26 45.62,18.26 46.15,18.8 U4.2
N$21  (via drill 0.25)
  Top 0.203: U3.12 v22.83,24.38 | v17.27,23.57 17.27,21.17 R10.2
  Bottom 0.203: v22.83,24.38 18.08,24.38 v17.27,23.57 21.46,19.38 30.35,19.38 32.31,17.42 JP8.1
N$22  (via drill 0.25)
  Top 0.203: v47.42,22.13 U4.3 47.41,20.23 47.41,18.82 46.39,17.81 R15.2
  Bottom 0.203: v47.42,22.13 47.42,20.75 47.55,20.63 JP13.1
N$23  (via drill 0.25)
  Top 0.203: v22.83,22.28 U3.3 22.83,18.72 21.81,17.69 R13.2
  Bottom 0.203: JP9.1 34.85,15.49 30.53,19.81 25.3,19.81 v22.83,22.28
N$24
  Top 0.406: U5.1 70.13,11.49 U5.2
  Top 0.813: MOT-1B1.1 69.57,8.2 70.13,8.76 70.13,11.49
N$26
  Top 0.254: U2.8 33.17,30.37 33.17,28.03 X1.1
  Top 0.406: C9.1 35.38,28.03 X1.1
N$27
  Top 0.203: U2.7
  Top 0.254: U2.7 32.64,30.97 32.64,27.25 31.81,26.43 X1.3
  Top 0.406: C10.1 31.98,25.03 31.98,25.99 X1.3
N$28
  Top 0.406: U5.11 76.63,11.49 U5.12
  Top 0.813: 76.63,11.49 76.63,8.74 77.19,8.18 MOT-1A2.1
N$29
  Top 0.406: U5.8 74.04,11.49 U5.7
  Top 0.813: 74.04,11.49 74.04,8.81 74.65,8.2 MOT-1A1.1
N$31
  Top 0.203: TM7.2 52.6,17.17 51.23,18.54 U4.6
N$38  (via drill 0.25)
  Top 0.203: U4.5 49.96,18.52 49.57,18.12 R16.2 49.59,16.97 50.67,16.97 51.16,16.48 v51.16,13.11
  Bottom 0.203: v51.16,13.11 52.63,11.63 JP15.1
N$41
  Top 1.016: SW1.3 46.43,52.43
  Top 1.65: 46.43,52.43 JP1.1
  Bottom 1.016: SW1.3 46.43,52.43
  Bottom 1.65: 46.43,52.43 JP1.1
N$47
  Top 0.203: TM8.2 59.08,17.17 59.51,17.6 59.51,21.79 58.67,22.63 54.76,22.63 52.83,24.56 51.66,24.56 51.23,24.99 U4.9
N$48  (via drill 0.25)
  Top 0.203: U4.10 49.94,26.36 49.94,24.92 51.26,23.6 52.27,23.6 v54.74,21.13 R12.2
  Bottom 0.203: v54.74,21.13 54.74,18.57 50.01,13.84 50.01,7.09 JP14.1
PB3  (via drill 0.25)
  Top 0.203: U4.7 52.5,21.82 51.82,22.5 50.72,22.5 v48.89,24.33 | U2.15 39.37,34.42 v40.72,33.07
  Bottom 0.203: v48.89,24.33 48.89,24.89 v40.72,33.07
PB4  (via drill 0.25)
  Top 0.203: U4.8 v52.5,28.6 | v41.91,32.97 U2.16
  Bottom 0.203: v52.5,28.6 51.23,29.87 45.01,29.87 v41.91,32.97
PC0  (via drill 0.25)
  Top 0.203: U4.14 44.88,27.76 v44.14,28.5 | v37.82,41.81 U2.23
  Bottom 0.203: v44.14,28.5 39.85,32.79 39.85,37.08 39.85,37.59 37.82,39.62 v37.82,41.81
PC1  (via drill 0.25)
  Top 0.203: U4.1 v44.88,22.25 | v37.01,42.82 37.01,42.13 U2.24
  Bottom 0.203: v44.88,22.25 44.04,23.09 42.75,23.09 42.04,23.8 42.04,29.77 39.32,32.49 39.32,37.39 37.01,39.7 v37.01,42.82
PC2  (via drill 0.25)
  Top 0.203: U3.7 v27.91,22.28 | v35.31,37.13 35.31,39.5 33.82,40.98 U2.25 | U2.25
  Bottom 0.203: v27.91,22.28 27.91,26.54 28.9,27.53 28.9,32.53 33.5,37.13 v35.31,37.13
PC3  (via drill 0.25)
  Top 0.203: U3.8 v27.91,28.35 | v34.59,37.95 34.59,39.15 U2.26 | U2.26
  Bottom 0.203: v27.91,28.35 27.91,32.16 33.71,37.95 v34.59,37.95
PC4  (via drill 0.25)
  Top 0.203: U3.1 20.29,22.05 21.69,23.44 23.16,23.44 v24.1,24.38 | v33.88,38.73 U2.27 | U2.27 | U2.27
  Bottom 0.203: v24.1,24.38 26.47,26.75 26.47,31.32 v33.88,38.73
PC5  (via drill 0.25)
  Top 0.2: v30.58,40.89 32.12,39.36
  Top 0.203: U3.14 v20.29,28.35 | U2.28 32.12,39.36 | 32.12,39.36
  Bottom 0.203: v20.29,28.35 22.86,28.35 31.88,37.36 31.88,39.6 v30.58,40.89
PWM_M1
  Top 0.203: U2.9 37.27,29.69 53.77,29.69 62.46,21.01 69.67,21.01 70.46,20.22 U5.23 | U2.9
PWM_M2
  Top 0.203: U2.14 40.69,31.93 54.59,31.93 60.13,26.39 69.78,26.39 75.66,20.51 U5.15 | U2.14
RST  (via drill 0.25)
  Top 0.203: SW5.A SW5.A' 7.08,20.76 C12.1 7.1,22.34 v7.09,22.35 7.09,24.43 5.28,26.24 JP5.1 | U2.29 v30.45,39.9 | U2.29
  Bottom 0.203: v30.45,39.9 29.77,39.22 14.96,39.22 12.95,37.21 12.95,31.14 7.09,25.27 v7.09,22.35
RX  (via drill 0.25)
  Top 0.305: v20.17,42.24 R4.1
  Bottom 0.203: 2.18,23.77 JP6.1
  Bottom 0.305: 2.18,23.77 3.99,23.77 11.81,31.6 11.81,37.69 16.36,42.24 v20.17,42.24
RX.
  Top 0.203: U2.30
  Top 0.305: U2.30 26.98,42.24 R4.2
TX  (via drill 0.25)
  Top 0.305: v20.17,40.46 R5.1
  Bottom 0.203: 2.11,21.06 JP7.1
  Bottom 0.305: v20.17,40.46 15.44,40.46 12.42,37.44 12.42,31.37 2.11,21.06
TX.
  Top 0.203: U2.31
  Top 0.305: R5.2 27.63,40.46 U2.31
USR_SW1
  Top 0.203: SW3.B SW3.B' | R2.1 29.76,44.44 30.56,43.64 37.49,43.64 38.61,42.52 38.61,41.47 U2.22
  Top 0.254: SW3.B 30.2,48.11 29.76,47.67 R2.1
USR_SW2  (via drill 0.25)
  Top 0.203: SW2.B' SW2.B 19.24,48.1 R1.1 v19.25,43.71 | v40.79,40.21 38.81,38.23 U2.19 | U2.19
  Bottom 0.203: v19.25,43.71 34.09,43.71 34.85,44.48 37.41,44.48 40.79,41.1 v40.79,40.21
(copper drawn outside any net)
  shapes: Top area x889, Top circle x1

### Text on the board
tPlace: USR_SW_1 | USR_SW_2 | POWER SW | MODOS | RX | TX | RST_SW | 5V | GND
tNames: U1 | BAT / 13V MAX | SW2 | C1 | C2 | C3 | GND | X1 | C9 | RST | C10 | C12 | OPONENTE | DOHYO | DM-1 | SW5 | MOT-1 | MOT-2
bNames: BAT / 13V MAX | GND | RST | RX | TX | OPONENTE | DOHYO | MOT-1 | MOT-2 | 5V | GND